# Altium schematic sheet 15to3.3V.SchDoc
size A; SheetNumber: 2; SheetTotal: 2
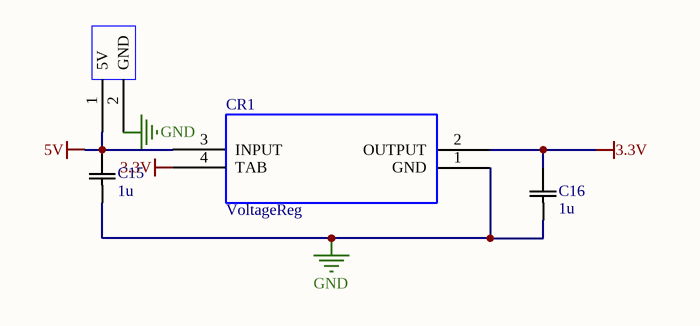
[diagram p0: 15to3.3V.SchDoc]

## Parts
C15  1u  [Resistor1]
C16  1u  [Resistor1]
CR1  VoltageReg  [VoltageReg1]
U21  Input  [Input]  (value not drawn)

## Nets
3.3V: C16.2 CR1.2(OUTPUT) CR1.4(TAB)
5V: C15.2 CR1.3(INPUT) U21.1(5V)
GND: C15.1 C16.1 CR1.1(GND) U21.2(GND)

## Library data of the parts
C15 C16 = Capacitor1u: C0805C103J1GEC7800; Mfr_Name: Murata
CR1 = VoltageReg: LD1117S33TR; Mfr_Name: STMicroelectronics; RefDes: RefDes; Type: Type